# EAGLE design tweeq-extMod_DRV8830 (EAGLE 7.2.0)
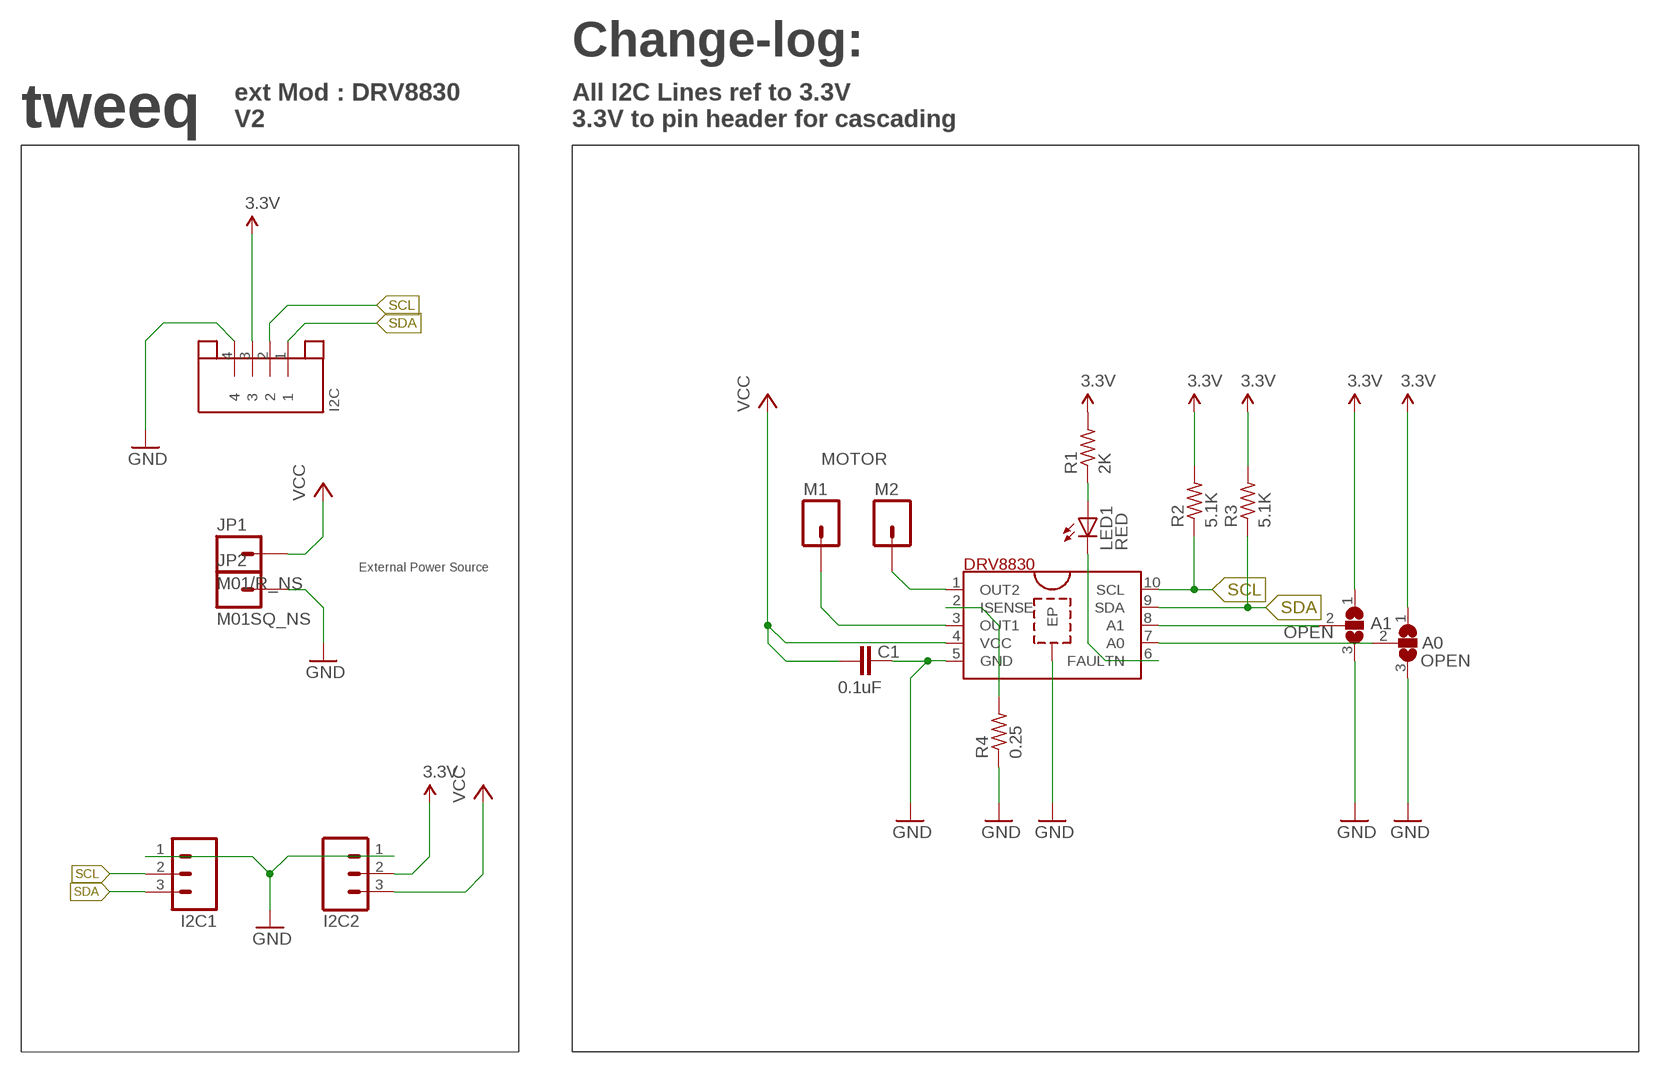
[diagram p0: schematic, sheet 1]

## Parts
A0  OPEN  JUMPER_SJ2WS  [JUMPER_SJ_S]
A1  OPEN  JUMPER_SJ2WS  [JUMPER_SJ_S]
C1  0.1uF  C-EUC0402K  [C0402K]
DRV8830  DRV8830DGQ  [MSOP10_POWERPAD]
I2C  JST-4PINSH  [SH1.0-4PIN]
I2C1  M03/NS  [1X03_NS]
I2C2  M03/NS  [1X03_NS]
JP1  M01/R_NS  [1X01NS]
JP2  M01SQ_NS  [1X01_SQ]
LED1  RED  LEDCHIPLED_0805  [CHIPLED_0805]
M1  M01SQ_NS  [1X01_SQ]
M2  M01SQ_NS  [1X01_SQ]
R1  2K  R-US_R0402  [R0402]
R2  5.1K  R-US_R0402  [R0402]
R3  5.1K  R-US_R0402  [R0402]
R4  0.25  R-US_R0402  [R0402]

## Nets
3.3V: A0.1 A1.1 I2C2.2 I2C.3 R1.2 R2.2 R3.2
GND: A0.3 A1.3 C1.2 DRV8830.5(GND) DRV8830.EP I2C1.1 I2C2.1 I2C.4 JP2.1 R4.1
N$1: A1.2 DRV8830.8(A1)
N$2: A0.2 DRV8830.7(A0)
N$5: DRV8830.6(FAULTN) LED1.C
N$6: LED1.A R1.1
N$7: DRV8830.1(OUT2) M2.1
N$8: DRV8830.3(OUT1) M1.1
N$9: DRV8830.2(ISENSE) R4.2
SCL: DRV8830.10(SCL) I2C1.2 I2C.2 R2.1
SDA: DRV8830.9(SDA) I2C1.3 I2C.1 R3.1
VCC: C1.1 DRV8830.4(VCC) I2C2.3 JP1.1

## Notes on the sheet
- Change-log:
- tweeq
- ext Mod : DRV8830
  V2
- All I2C Lines ref to 3.3V
  3.3V to pin header for cascading
- MOTOR
- External Power Source

## Library data of the parts
A0 A1 = AISCube:JUMPER_SJ2W: SMD solder JUMPER
C1 = AISCube:C-EU: CAPACITOR, European symbol
DRV8830 = AISCube:DRV8830
I2C = AISCube:JST-4PIN: JST 4 Pin
I2C1 I2C2 = AISCube:M03: Header 3 Standard 3-pin 0.1" header
JP1 JP2 M1 M2 = AISCube:M01: Header 1 Standard 1-pin 0.1" header.
LED1 = AISCube:LED: LED OSRAM: - CHIPLED LG R971, LG N971, LY N971, LG Q971, LY Q971, LO R971, LY R971 LH N974, LH R974 LS Q976, LO Q976, LY Q976 LO Q996 - Hyper CHIPLED LW Q18S LB Q993, LB Q99A, LB R99A - SideLED LS A670, LO A670, LY A670, LG A670, LP A670 LB A673, LV A673, LT A673, LW A673 LH A674 LY A675 LS A676, LA A676, LO A676, LY A676, LW A676 LS A679, LY A679, LG A679 - Hyper Micro SIDELED® LS Y876, LA Y876, LO Y876, LY Y876 LT Y87S - SmartLED LW L88C, LW L88S LB L89C, LB L89S, LG L890 LS L89K, LO L89K, LY L89K LS L896, LA L896, LO L896, LY L896 - TOPLED LS T670, LO T670, LY T670, LG T670, LP T670 LSG T670, LSP T670, LSY T670, LOP T670, LYG T670 LG T671, LOG T671, LSG T671 LB T673, LV T673, LT T673, LW T673 LH T674 LS T676, LA T676, LO T676, LY T676, LB T676, LH T676, LSB T676, LW T676 LB T67C, LV T67C, LT T67C, LS T67K, LO T67K, LY T67K, LW E67C LS E67B, LA E67B, LO E67B, LY E67B, LB E67C, LV E67C, LT E67C LW T67C LS T679, LY T679, LG T679 LS T770, LO T770, LY T770, LG T770, LP T770 LB T773, LV T773, LT T773, LW T773 LH T774 LS E675, LA E675, LY E675, LS T675 LS T776, LA T776, LO T776, LY T776, LB T776 LHGB T686 LT T68C, LB T68C - Hyper Mini TOPLED® LB M676 - Mini TOPLED Santana® LG M470 LS M47K, LO M47K, LY M47K Source: http://www.osram.convergy.de/
R1-R4 = AISCube:R-US_: RESISTOR, American symbol

## Board
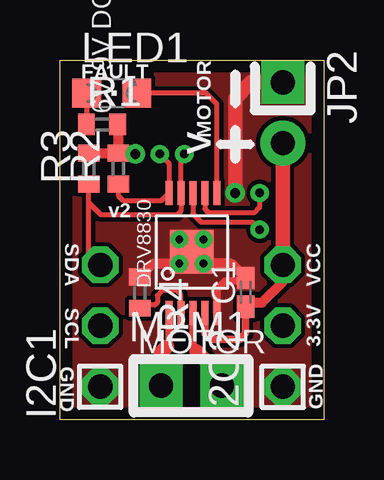
[diagram p1: board, top side]
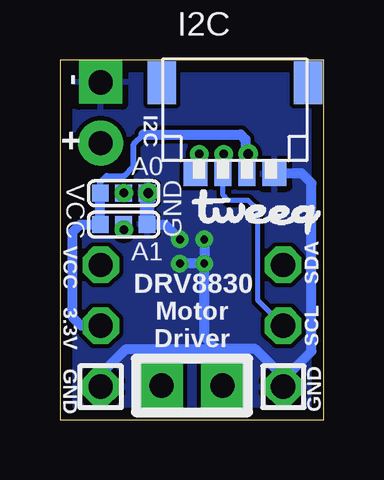
[diagram p2: board, bottom side, seen from below]

Size 11 x 15 mm. Coordinates in mm from the lower left corner, seen from the top.
Outline: 0,15 11,15 11,0 0,0 0,15
Copper layers (1*16): Top 0.0356mm / dielectric 1.5011mm / Bottom 0.0356mm
Design rules "AISCube": minimum track width 7mil, minimum drill 14mil, track to track 7mil, track to pad 7mil, pad to pad 7mil, via to via 7mil, smd to smd 0mil, copper to edge 20mil, drill to drill 8mil, minimum pad ring 10mil, minimum via ring 8mil, stop-mask expansion 4mil, vias tented up to drill 32mil, thermal gap 10mil

### Footprints (pad centres in the part's own frame; a part is rotated, then mirrored left to right if it is on the bottom)
JUMPER_SJ_S = smd 0.7 x 0.7: 1 -0.974,-0.02; 2 0,-0.02; 3 0.974,-0.02
C0402K = smd 0.925 x 0.74: 1 -0.6,0; 2 0.6,0
MSOP10_POWERPAD = smd 1 x 0.3: 1 -2.55,0.95; 2 -2.55,0.45; 3 -2.55,-0.05; 4 -2.55,-0.55; 5 -2.55,-1.05; 6 2.45,-1.05; 7 2.45,-0.55; 8 2.45,-0.05; 9 2.45,0.45; 10 2.45,0.95 | smd 1.8 x 1.8: EP 0,0
SH1.0-4PIN = smd 1 x 1: 1 -1.65,-0.55; 4 1.65,-0.55 | smd 0.7 x 1: 2 -0.5,-0.55; 3 0.5,-0.55 | smd 1.2 x 1.8: P$1 -3.05,3.25; P$2 3.05,3.25
1X03_NS = drill 1.016 pad 1.524 octagon: 1 0,0; 2 2.54,0; 3 5.08,0
1X01NS = drill 1.016 pad 1.88: 1 0,0
1X01_SQ = drill 1.016 pad 1.8 square: 1 0,0
CHIPLED_0805 = smd 1.2 x 1.2: A 0,-1.05; C 0,1.05
R0402 = smd 0.7 x 0.9: 1 -0.65,0; 2 0.65,0

### Placement (x,y rotation side)
A0  8.34,9.46 0 bottom
A1  8.34,8.15 0 bottom
C1  7.75,5.31 90 top
DRV8830  5.5,7 90 top
I2C  3.7,10.8 0 bottom
I2C1  1.68,1.37 90 top
I2C2  9.3,1.37 90 top
JP1  9.3,11.53 270 top
JP2  9.3,14.07 270 top
LED1  2.16,13.61 270 top
M1  6.76,1.41 0 top
M2  4.22,1.41 0 top
R1  1.76,12.31 0 top
R2  2.43,10.47 90 top
R3  1.2,10.47 90 top
R4  3.33,5.29 270 top
U$1  [TWEEQ-LOGO-S]  5.49,7.72 0 bottom

### Tracks (layer width: path | path; a pad name or v marks a point on that pad's centre or on a via)
3.3V  (via drill 0.41)
  Top 0.406: R3.2 R2.2 | R1.2 2.43,12.28 R2.2 | v3.15,11.07 3.1,11.12 R2.2
  Bottom 0.254: A0.1 9.31,9.89 9.04,10.16 8.33,10.16 7.92,10.57 7.92,11.48 7.52,11.89
  Bottom 0.406: A0.1 A1.1 10.16,8.13 10.46,7.82 10.46,4.27 10.11,3.91 I2C2.2 | v3.15,11.07 3.15,10.3 I2C.3 3.25,10.3 3.25,11.68 3.45,11.89 7.52,11.89
GND  (via drill 0.33, 0.41)
  Top 0.305: DRV8830.5 6.55,5.43 6.91,5.79 7.63,5.79 C1.2
  Top 0.406: v5.99,7.52 v4.98,7.52 | R4.1 3.89,6.5 v4.98,6.5 | C1.2 7.15,6.5 v5.99,6.5 v5.99,6.51 DRV8830.EP
  Top 0.61: v7.32,9.45 7.32,13.41 7.97,14.07 JP2.1
  Bottom 0.203: A0.3 v7.32,9.44 v7.32,9.45
  Bottom 0.406: v4.98,6.5 v5.99,6.5 | A1.3 6.61,8.13 v5.99,7.52 | v4.98,7.52 v4.98,6.5 | 1.68,1.78 2.85,2.95 3.66,2.95 4.47,2.95 | I2C2.1 9.3,1.88 8.23,2.95 4.47,2.95 | 1.68,1.78 1.57,1.78 0.51,2.85 0.51,9.86 0.91,10.26 2.04,10.26 I2C.4 | 1.68,1.78 I2C1.1 | 4.47,2.95 4.98,3.45 v4.98,6.5
  Bottom 0.61: A1.3 A0.3
  pour Top (no thermals): 10.9,14.8 10.9,0.18 0.15,0.18 0.15,14.8
  pour Bottom: 10.9,0.18 10.9,14.8 0.15,14.8 0.15,0.18
N$1  (via drill 0.36)
  Top 0.203: DRV8830.8 5.55,8.57 5.89,8.23 8.03,8.23 v8.33,7.92
  Bottom 0.203: v8.33,7.92 A1.2
N$2  (via drill 0.36)
  Top 0.203: DRV8830.7 6.05,8.78 6.2,8.64 8.13,8.64 8.33,8.84 v8.33,9.45
  Bottom 0.203: A0.2 v8.33,9.45
N$5
  Top 0.203: DRV8830.6 6.55,13.16 6.1,13.61 LED1.C
N$6
  Top 0.203: LED1.A R1.1
N$7
  Top 0.305: DRV8830.1 4.55,3.13 4.47,3.05
  Top 0.61: 4.47,3.05 4.22,2.8 M2.1
N$8
  Top 0.305: DRV8830.3 5.55,2.98 5.69,2.85
  Top 0.61: 5.69,2.85 6.76,1.77 M1.1
N$9
  Top 0.203: DRV8830.2 5.05,5.21 4.88,5.38 4.27,5.38 4.06,5.18 4.06,4.88 3.96,4.78 3.47,4.78 R4.2
SCL  (via drill 0.36)
  Top 0.203: R2.1 2.43,9.35 2.64,9.14 4.24,9.14 DRV8830.10 4.55,10.69 v4.17,11.07
  Bottom 0.203: v4.17,11.07 4.17,10.28 I2C.2 4.2,9.38 3.96,9.14 3.15,9.14 2.74,8.74 2.74,4.97 I2C1.2
SDA  (via drill 0.36)
  Top 0.203: v5.18,11.07 5.05,10.94 DRV8830.9 5.05,8.71 4.88,8.53 1.71,8.53 1.2,9.04 R3.1 1.2,6.93 I2C1.3
  Bottom 0.203: I2C.1 5.28,10.32 5.28,10.97 v5.18,11.07
VCC
  Top 0.305: DRV8830.4 6.05,3.6 6.3,3.35 7.52,3.35 7.75,3.58 C1.1
  Top 0.406: C1.1 7.92,4.88 8.43,4.88 9.3,5.74 I2C2.3
  Top 0.61: I2C2.3 JP1.1

### Text on the board
tPlace: FAULT | MOTOR | V | v2 | SDA | VCC | SCL | 3.3V | MOTOR | GND | GND
bPlace: - | I2C | + | A0 | GND | VCC | SDA | A1 | DRV8830 | VCC | SCL | Motor / Driver | 3.3V | GND | GND
tNames: 6V-9V DC | ON
bNames: Breadboard | V-Reg | Module